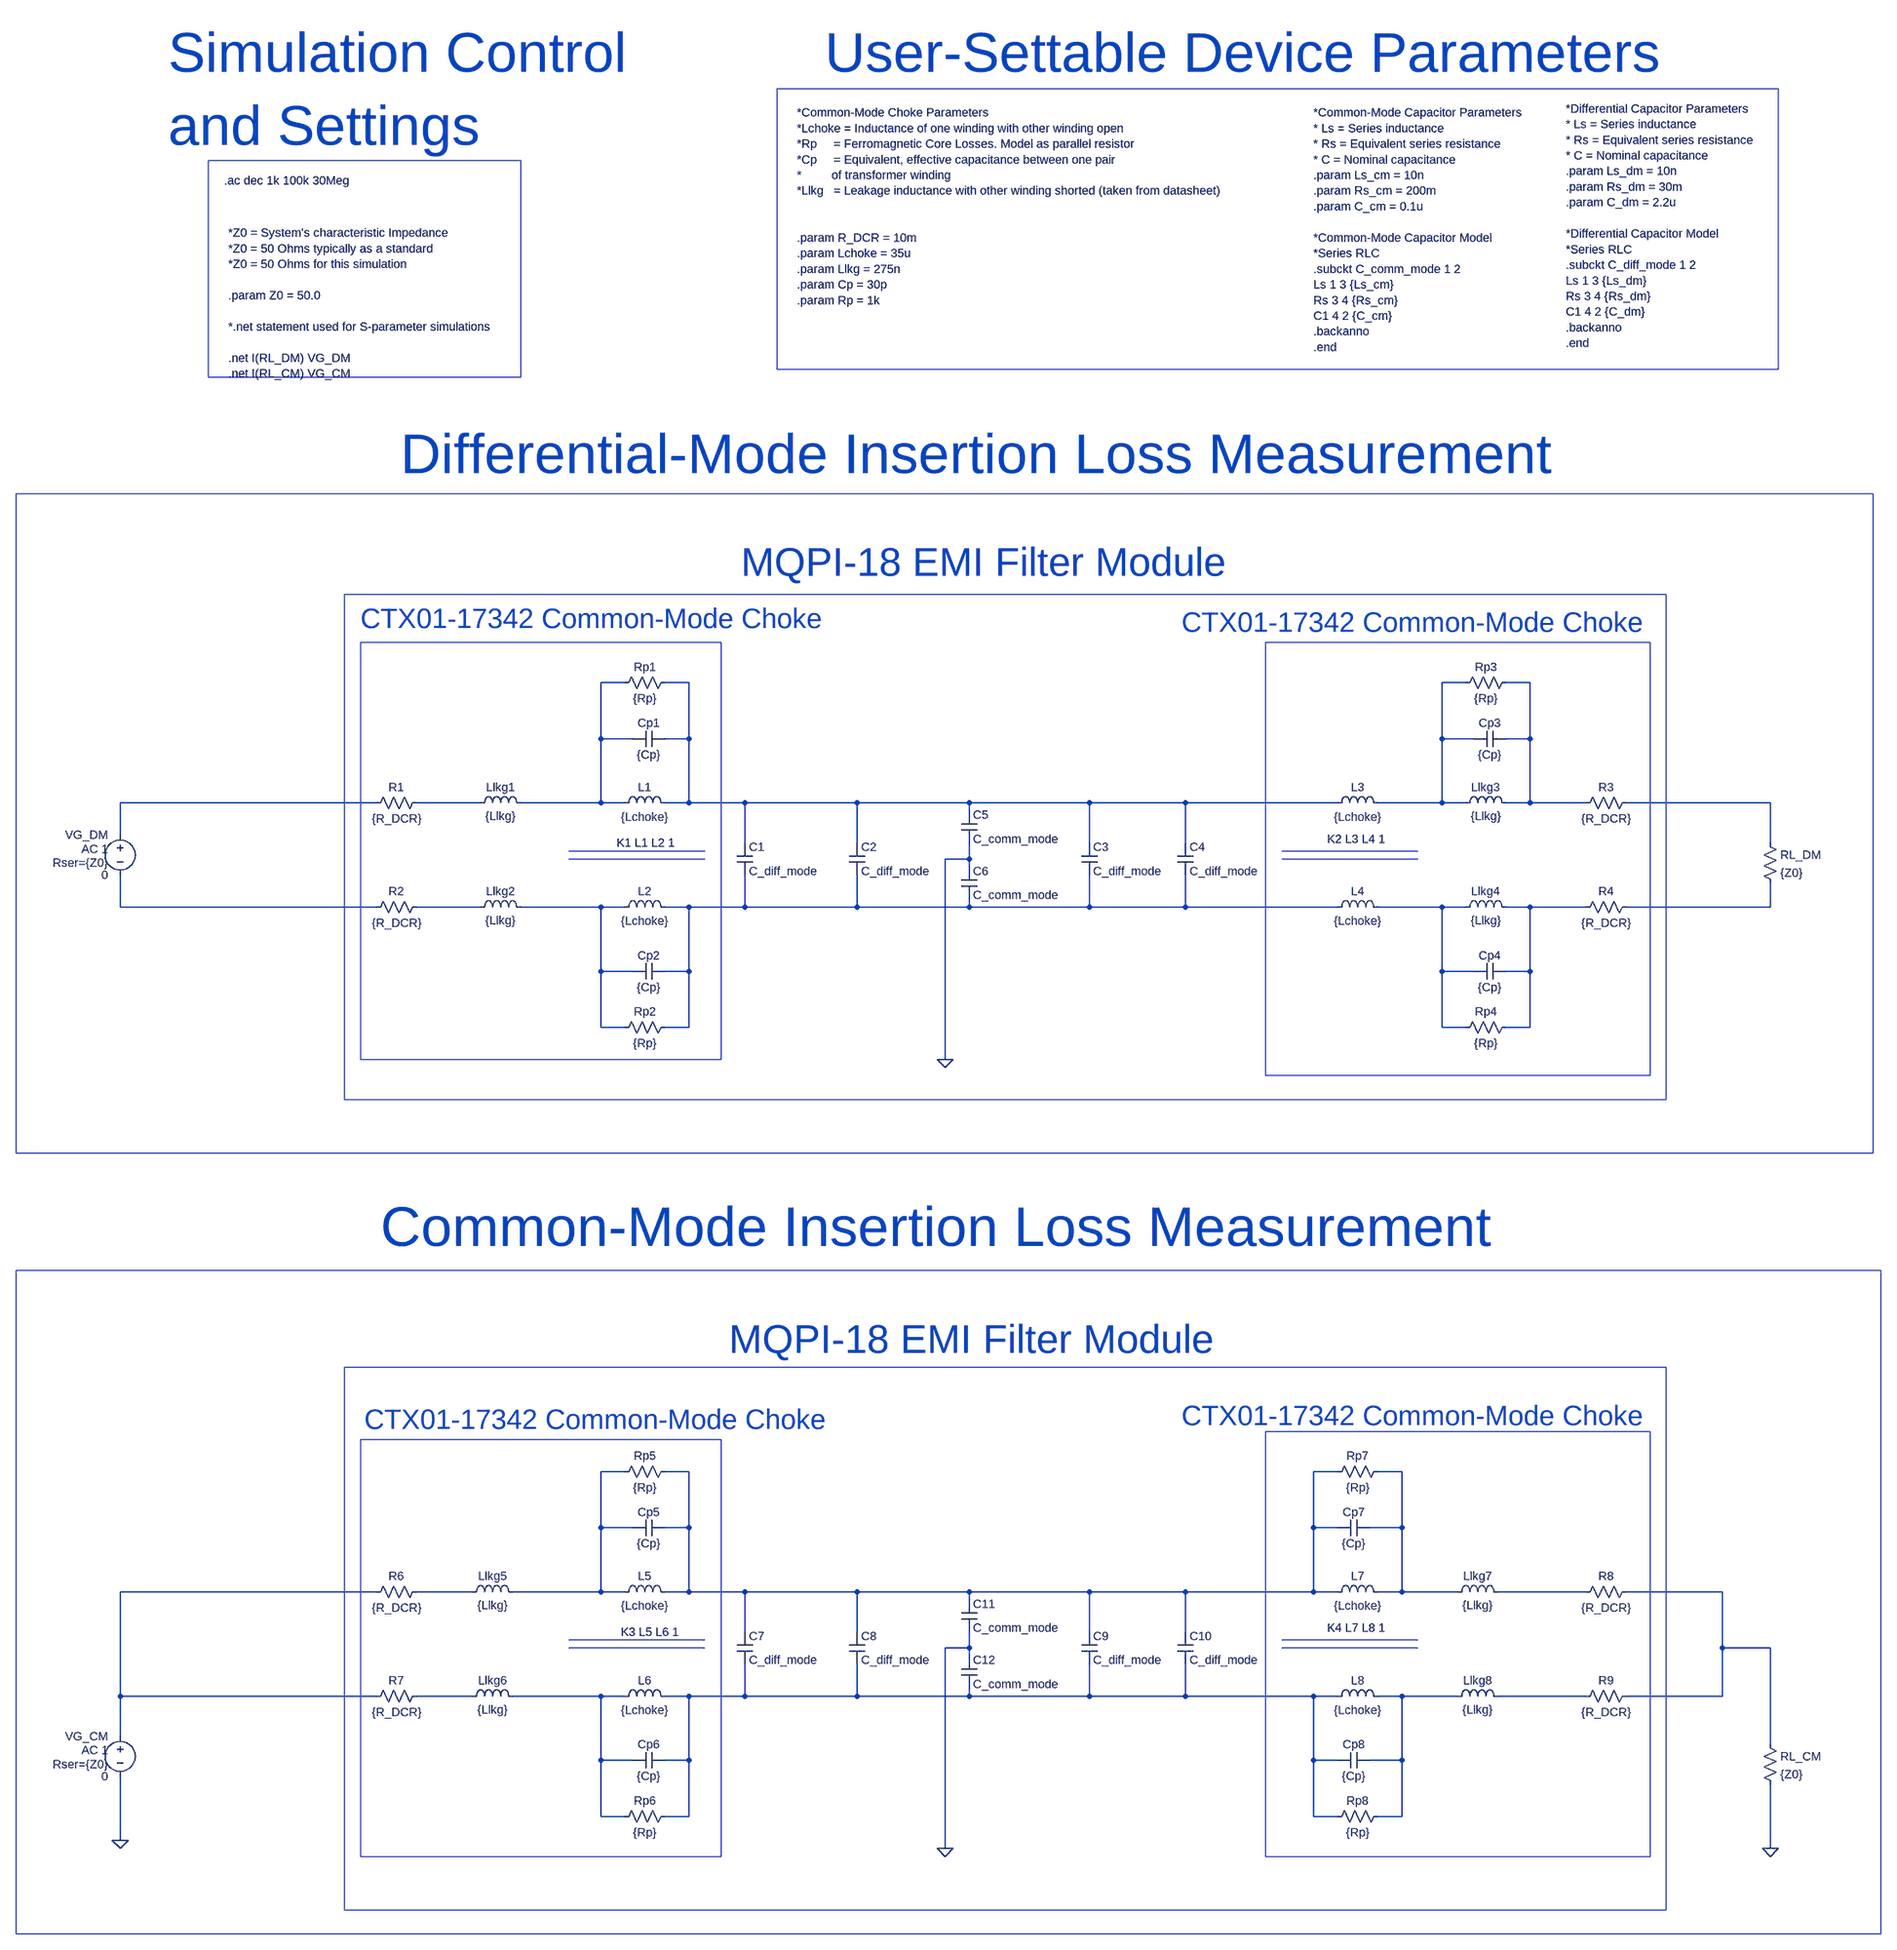
[diagram p0: schematic MQPI-18_VICOR_EMI_Filter.asc]
MQPI-18_VICOR_EMI_Filter.asc, the LTspice schematic file:
Version 4.1
SHEET 1 4008 2036
WIRE 1184 -672 1136 -672
WIRE 1312 -672 1264 -672
WIRE 2864 -672 2816 -672
WIRE 2992 -672 2944 -672
WIRE 1136 -560 1136 -672
WIRE 1200 -560 1136 -560
WIRE 1312 -560 1312 -672
WIRE 1312 -560 1264 -560
WIRE 2816 -560 2816 -672
WIRE 2880 -560 2816 -560
WIRE 2992 -560 2992 -672
WIRE 2992 -560 2944 -560
WIRE 688 -432 176 -432
WIRE 896 -432 768 -432
WIRE 1136 -432 1136 -560
WIRE 1136 -432 976 -432
WIRE 1184 -432 1136 -432
WIRE 1312 -432 1312 -560
WIRE 1312 -432 1264 -432
WIRE 1424 -432 1312 -432
WIRE 1648 -432 1424 -432
WIRE 1872 -432 1648 -432
WIRE 2112 -432 1872 -432
WIRE 2304 -432 2112 -432
WIRE 2608 -432 2304 -432
WIRE 2816 -432 2816 -560
WIRE 2816 -432 2688 -432
WIRE 2864 -432 2816 -432
WIRE 2992 -432 2992 -560
WIRE 2992 -432 2944 -432
WIRE 3104 -432 2992 -432
WIRE 3472 -432 3184 -432
WIRE 1872 -416 1872 -432
WIRE 176 -368 176 -432
WIRE 1424 -352 1424 -432
WIRE 1648 -352 1648 -432
WIRE 2112 -352 2112 -432
WIRE 2304 -352 2304 -432
WIRE 3472 -352 3472 -432
WIRE 1872 -320 1872 -352
WIRE 1872 -320 1824 -320
WIRE 1872 -304 1872 -320
WIRE 176 -224 176 -288
WIRE 688 -224 176 -224
WIRE 896 -224 768 -224
WIRE 1136 -224 976 -224
WIRE 1184 -224 1136 -224
WIRE 1312 -224 1264 -224
WIRE 1424 -224 1424 -288
WIRE 1424 -224 1312 -224
WIRE 1648 -224 1648 -288
WIRE 1648 -224 1424 -224
WIRE 1872 -224 1872 -240
WIRE 1872 -224 1648 -224
WIRE 2112 -224 2112 -288
WIRE 2112 -224 1872 -224
WIRE 2304 -224 2304 -288
WIRE 2304 -224 2112 -224
WIRE 2608 -224 2304 -224
WIRE 2816 -224 2688 -224
WIRE 2864 -224 2816 -224
WIRE 2992 -224 2944 -224
WIRE 3104 -224 2992 -224
WIRE 3472 -224 3472 -272
WIRE 3472 -224 3184 -224
WIRE 1136 -96 1136 -224
WIRE 1200 -96 1136 -96
WIRE 1312 -96 1312 -224
WIRE 1312 -96 1264 -96
WIRE 2816 -96 2816 -224
WIRE 2880 -96 2816 -96
WIRE 2992 -96 2992 -224
WIRE 2992 -96 2944 -96
WIRE 1136 16 1136 -96
WIRE 1184 16 1136 16
WIRE 1312 16 1312 -96
WIRE 1312 16 1264 16
WIRE 2816 16 2816 -96
WIRE 2864 16 2816 16
WIRE 2992 16 2992 -96
WIRE 2992 16 2944 16
WIRE 1824 80 1824 -320
WIRE 1184 1056 1136 1056
WIRE 1312 1056 1264 1056
WIRE 2608 1056 2560 1056
WIRE 2736 1056 2688 1056
WIRE 1136 1168 1136 1056
WIRE 1200 1168 1136 1168
WIRE 1312 1168 1312 1056
WIRE 1312 1168 1264 1168
WIRE 2560 1168 2560 1056
WIRE 2608 1168 2560 1168
WIRE 2736 1168 2736 1056
WIRE 2736 1168 2672 1168
WIRE 688 1296 176 1296
WIRE 880 1296 768 1296
WIRE 1136 1296 1136 1168
WIRE 1136 1296 960 1296
WIRE 1184 1296 1136 1296
WIRE 1312 1296 1312 1168
WIRE 1312 1296 1264 1296
WIRE 1424 1296 1312 1296
WIRE 1648 1296 1424 1296
WIRE 1872 1296 1648 1296
WIRE 2112 1296 1872 1296
WIRE 2304 1296 2112 1296
WIRE 2560 1296 2560 1168
WIRE 2560 1296 2304 1296
WIRE 2608 1296 2560 1296
WIRE 2736 1296 2736 1168
WIRE 2736 1296 2688 1296
WIRE 2848 1296 2736 1296
WIRE 3104 1296 2928 1296
WIRE 3376 1296 3184 1296
WIRE 1872 1312 1872 1296
WIRE 1424 1376 1424 1296
WIRE 1648 1376 1648 1296
WIRE 2112 1376 2112 1296
WIRE 2304 1376 2304 1296
WIRE 1872 1408 1872 1376
WIRE 1872 1408 1824 1408
WIRE 3376 1408 3376 1296
WIRE 3472 1408 3376 1408
WIRE 1872 1424 1872 1408
WIRE 176 1504 176 1296
WIRE 688 1504 176 1504
WIRE 880 1504 768 1504
WIRE 1136 1504 960 1504
WIRE 1184 1504 1136 1504
WIRE 1312 1504 1264 1504
WIRE 1424 1504 1424 1440
WIRE 1424 1504 1312 1504
WIRE 1648 1504 1648 1440
WIRE 1648 1504 1424 1504
WIRE 1872 1504 1872 1488
WIRE 1872 1504 1648 1504
WIRE 2112 1504 2112 1440
WIRE 2112 1504 1872 1504
WIRE 2304 1504 2304 1440
WIRE 2304 1504 2112 1504
WIRE 2560 1504 2304 1504
WIRE 2608 1504 2560 1504
WIRE 2736 1504 2688 1504
WIRE 2848 1504 2736 1504
WIRE 3104 1504 2928 1504
WIRE 3376 1504 3376 1408
WIRE 3376 1504 3184 1504
WIRE 176 1584 176 1504
WIRE 3472 1600 3472 1408
WIRE 1136 1632 1136 1504
WIRE 1200 1632 1136 1632
WIRE 1312 1632 1312 1504
WIRE 1312 1632 1264 1632
WIRE 2560 1632 2560 1504
WIRE 2608 1632 2560 1632
WIRE 2736 1632 2736 1504
WIRE 2736 1632 2672 1632
WIRE 1136 1744 1136 1632
WIRE 1184 1744 1136 1744
WIRE 1312 1744 1312 1632
WIRE 1312 1744 1264 1744
WIRE 2560 1744 2560 1632
WIRE 2608 1744 2560 1744
WIRE 2736 1744 2736 1632
WIRE 2736 1744 2688 1744
WIRE 176 1792 176 1664
WIRE 1824 1808 1824 1408
WIRE 3472 1808 3472 1680
FLAG 1824 80 0
FLAG 1824 1808 0
FLAG 176 1792 0
FLAG 3472 1808 0
SYMBOL ind 1280 -416 M270
WINDOW 0 32 56 VTop 2
WINDOW 3 4 56 VBottom 2
SYMATTR InstName L1
SYMATTR Value {Lchoke}
SYMATTR Type ind
SYMBOL ind 1280 -208 M270
WINDOW 0 32 56 VTop 2
WINDOW 3 4 56 VBottom 2
SYMATTR InstName L2
SYMATTR Value {Lchoke}
SYMATTR Type ind
SYMBOL ind 2592 -416 R270
WINDOW 0 32 56 VTop 2
WINDOW 3 4 56 VBottom 2
SYMATTR InstName L3
SYMATTR Value {Lchoke}
SYMATTR Type ind
SYMBOL ind 2592 -208 R270
WINDOW 0 32 56 VTop 2
WINDOW 3 4 56 VBottom 2
SYMATTR InstName L4
SYMATTR Value {Lchoke}
SYMATTR Type ind
SYMBOL cap 1408 -352 R0
SYMATTR InstName C1
SYMATTR Value C_diff_mode
SYMATTR Prefix X
SYMBOL cap 1632 -352 R0
SYMATTR InstName C2
SYMATTR Value C_diff_mode
SYMATTR Prefix X
SYMBOL cap 2096 -352 R0
SYMATTR InstName C3
SYMATTR Value C_diff_mode
SYMATTR Prefix X
SYMBOL cap 2288 -352 R0
SYMATTR InstName C4
SYMATTR Value C_diff_mode
SYMATTR Prefix X
SYMBOL cap 1856 -416 R0
SYMATTR InstName C5
SYMATTR Value C_comm_mode
SYMATTR Prefix X
SYMBOL cap 1856 -304 R0
SYMATTR InstName C6
SYMATTR Value C_comm_mode
SYMATTR Prefix X
SYMBOL res 3456 -368 R0
SYMATTR InstName RL_DM
SYMATTR Value {Z0}
SYMBOL voltage 176 -384 M0
WINDOW 123 24 44 Left 2
WINDOW 39 24 72 Left 2
SYMATTR InstName VG_DM
SYMATTR Value 0
SYMATTR Value2 AC 1
SYMATTR SpiceLine Rser={Z0}
SYMBOL res 672 -416 R270
WINDOW 0 32 56 VTop 2
WINDOW 3 0 56 VBottom 2
SYMATTR InstName R1
SYMATTR Value {R_DCR}
SYMBOL res 672 -208 R270
WINDOW 0 32 56 VTop 2
WINDOW 3 0 56 VBottom 2
SYMATTR InstName R2
SYMATTR Value {R_DCR}
SYMBOL res 3088 -416 R270
WINDOW 0 32 56 VTop 2
WINDOW 3 0 56 VBottom 2
SYMATTR InstName R3
SYMATTR Value {R_DCR}
SYMBOL res 3088 -208 R270
WINDOW 0 32 56 VTop 2
WINDOW 3 0 56 VBottom 2
SYMATTR InstName R4
SYMATTR Value {R_DCR}
SYMBOL ind 1280 1312 M270
WINDOW 0 32 56 VTop 2
WINDOW 3 4 56 VBottom 2
SYMATTR InstName L5
SYMATTR Value {Lchoke}
SYMATTR Type ind
SYMBOL ind 1280 1520 M270
WINDOW 0 32 56 VTop 2
WINDOW 3 4 56 VBottom 2
SYMATTR InstName L6
SYMATTR Value {Lchoke}
SYMATTR Type ind
SYMBOL ind 2592 1312 R270
WINDOW 0 32 56 VTop 2
WINDOW 3 4 56 VBottom 2
SYMATTR InstName L7
SYMATTR Value {Lchoke}
SYMATTR Type ind
SYMBOL ind 2592 1520 R270
WINDOW 0 32 56 VTop 2
WINDOW 3 4 56 VBottom 2
SYMATTR InstName L8
SYMATTR Value {Lchoke}
SYMATTR Type ind
SYMBOL cap 1408 1376 R0
SYMATTR InstName C7
SYMATTR Value C_diff_mode
SYMATTR Prefix X
SYMBOL cap 1632 1376 R0
SYMATTR InstName C8
SYMATTR Value C_diff_mode
SYMATTR Prefix X
SYMBOL cap 2096 1376 R0
SYMATTR InstName C9
SYMATTR Value C_diff_mode
SYMATTR Prefix X
SYMBOL cap 2288 1376 R0
SYMATTR InstName C10
SYMATTR Value C_diff_mode
SYMATTR Prefix X
SYMBOL cap 1856 1312 R0
SYMATTR InstName C11
SYMATTR Value C_comm_mode
SYMATTR Prefix X
SYMBOL cap 1856 1424 R0
SYMATTR InstName C12
SYMATTR Value C_comm_mode
SYMATTR Prefix X
SYMBOL res 3456 1584 R0
SYMATTR InstName RL_CM
SYMATTR Value {Z0}
SYMBOL voltage 176 1568 M0
WINDOW 123 24 44 Left 2
WINDOW 39 24 72 Left 2
SYMATTR InstName VG_CM
SYMATTR Value 0
SYMATTR Value2 AC 1
SYMATTR SpiceLine Rser={Z0}
SYMBOL res 672 1312 R270
WINDOW 0 32 56 VTop 2
WINDOW 3 0 56 VBottom 2
SYMATTR InstName R6
SYMATTR Value {R_DCR}
SYMBOL res 672 1520 R270
WINDOW 0 32 56 VTop 2
WINDOW 3 0 56 VBottom 2
SYMATTR InstName R7
SYMATTR Value {R_DCR}
SYMBOL res 3088 1312 R270
WINDOW 0 32 56 VTop 2
WINDOW 3 0 56 VBottom 2
SYMATTR InstName R8
SYMATTR Value {R_DCR}
SYMBOL res 3088 1520 R270
WINDOW 0 32 56 VTop 2
WINDOW 3 0 56 VBottom 2
SYMATTR InstName R9
SYMATTR Value {R_DCR}
SYMBOL ind 992 -416 M270
WINDOW 0 32 56 VTop 2
WINDOW 3 5 56 VBottom 2
SYMATTR InstName Llkg1
SYMATTR Value {Llkg}
SYMBOL ind 992 -208 M270
WINDOW 0 32 56 VTop 2
WINDOW 3 5 56 VBottom 2
SYMATTR InstName Llkg2
SYMATTR Value {Llkg}
SYMBOL ind 2848 -416 R270
WINDOW 0 32 56 VTop 2
WINDOW 3 5 56 VBottom 2
SYMATTR InstName Llkg3
SYMATTR Value {Llkg}
SYMBOL ind 2848 -208 R270
WINDOW 0 32 56 VTop 2
WINDOW 3 5 56 VBottom 2
SYMATTR InstName Llkg4
SYMATTR Value {Llkg}
SYMBOL ind 976 1312 M270
WINDOW 0 32 56 VTop 2
WINDOW 3 5 56 VBottom 2
SYMATTR InstName Llkg5
SYMATTR Value {Llkg}
SYMBOL ind 976 1520 M270
WINDOW 0 32 56 VTop 2
WINDOW 3 5 56 VBottom 2
SYMATTR InstName Llkg6
SYMATTR Value {Llkg}
SYMBOL ind 2832 1312 R270
WINDOW 0 32 56 VTop 2
WINDOW 3 5 56 VBottom 2
SYMATTR InstName Llkg7
SYMATTR Value {Llkg}
SYMBOL ind 2832 1520 R270
WINDOW 0 32 56 VTop 2
WINDOW 3 5 56 VBottom 2
SYMATTR InstName Llkg8
SYMATTR Value {Llkg}
SYMBOL cap 1200 -80 R270
WINDOW 0 32 32 VTop 2
WINDOW 3 0 32 VBottom 2
SYMATTR InstName Cp2
SYMATTR Value {Cp}
SYMBOL cap 1200 -544 R270
WINDOW 0 32 32 VTop 2
WINDOW 3 0 32 VBottom 2
SYMATTR InstName Cp1
SYMATTR Value {Cp}
SYMBOL cap 2880 -576 M90
WINDOW 0 0 32 VBottom 2
WINDOW 3 32 32 VTop 2
SYMATTR InstName Cp3
SYMATTR Value {Cp}
SYMBOL cap 2880 -112 M90
WINDOW 0 0 32 VBottom 2
WINDOW 3 32 32 VTop 2
SYMATTR InstName Cp4
SYMATTR Value {Cp}
SYMBOL cap 1200 1152 M90
WINDOW 0 0 32 VBottom 2
WINDOW 3 32 32 VTop 2
SYMATTR InstName Cp5
SYMATTR Value {Cp}
SYMBOL cap 1200 1616 M90
WINDOW 0 0 32 VBottom 2
WINDOW 3 32 32 VTop 2
SYMATTR InstName Cp6
SYMATTR Value {Cp}
SYMBOL cap 2672 1152 R90
WINDOW 0 0 32 VBottom 2
WINDOW 3 32 32 VTop 2
SYMATTR InstName Cp7
SYMATTR Value {Cp}
SYMBOL cap 2672 1616 R90
WINDOW 0 0 32 VBottom 2
WINDOW 3 32 32 VTop 2
SYMATTR InstName Cp8
SYMATTR Value {Cp}
SYMBOL res 1168 -656 R270
WINDOW 0 32 56 VTop 2
WINDOW 3 0 56 VBottom 2
SYMATTR InstName Rp1
SYMATTR Value {Rp}
SYMBOL res 1168 32 R270
WINDOW 0 32 56 VTop 2
WINDOW 3 0 56 VBottom 2
SYMATTR InstName Rp2
SYMATTR Value {Rp}
SYMBOL res 2848 -656 R270
WINDOW 0 32 56 VTop 2
WINDOW 3 0 56 VBottom 2
SYMATTR InstName Rp3
SYMATTR Value {Rp}
SYMBOL res 2848 32 R270
WINDOW 0 32 56 VTop 2
WINDOW 3 0 56 VBottom 2
SYMATTR InstName Rp4
SYMATTR Value {Rp}
SYMBOL res 1168 1072 R270
WINDOW 0 32 56 VTop 2
WINDOW 3 0 56 VBottom 2
SYMATTR InstName Rp5
SYMATTR Value {Rp}
SYMBOL res 1168 1760 R270
WINDOW 0 32 56 VTop 2
WINDOW 3 0 56 VBottom 2
SYMATTR InstName Rp6
SYMATTR Value {Rp}
SYMBOL res 2592 1072 R270
WINDOW 0 32 56 VTop 2
WINDOW 3 0 56 VBottom 2
SYMATTR InstName Rp7
SYMATTR Value {Rp}
SYMBOL res 2592 1760 R270
WINDOW 0 32 56 VTop 2
WINDOW 3 0 56 VBottom 2
SYMATTR InstName Rp8
SYMATTR Value {Rp}
TEXT 1168 -352 Left 2 !K1 L1 L2 1
TEXT 2704 -360 Right 2 !K2 L3 L4 1
TEXT 1528 -1968 Left 2 !*Common-Mode Choke Parameters\n*Lchoke = Inductance of one winding with other winding open\n*Rp     = Ferromagnetic Core Losses. Model as parallel resistor\n*Cp     = Equivalent, effective capacitance between one pair\n*         of transformer winding\n*Llkg   = Leakage inductance with other winding shorted (taken from datasheet)\n \n \n.param R_DCR = 10m\n.param Lchoke = 35u\n.param Llkg = 275n\n.param Cp = 30p\n.param Rp = 1k
TEXT 384 -1832 Left 2 !.ac dec 1k 100k 30Meg
TEXT 392 -1728 Left 2 !*Z0 = System's characteristic Impedance\n*Z0 = 50 Ohms typically as a standard\n*Z0 = 50 Ohms for this simulation\n \n.param Z0 = 50.0\n \n*.net statement used for S-parameter simulations\n \n.net I(RL_DM) VG_DM\n.net I(RL_CM) VG_CM
TEXT 3064 -1976 Left 2 !*Differential Capacitor Parameters\n* Ls = Series inductance\n* Rs = Equivalent series resistance \n* C = Nominal capacitance\n.param Ls_dm = 10n\n.param Rs_dm = 30m\n.param C_dm = 2.2u\n \n*Differential Capacitor Model\n*Series RLC\n.subckt C_diff_mode 1 2\nLs 1 3 {Ls_dm}\nRs 3 4 {Rs_dm}\nC1 4 2 {C_dm}\n.backanno\n.end
TEXT 2560 -1968 Left 2 !*Common-Mode Capacitor Parameters\n* Ls = Series inductance\n* Rs = Equivalent series resistance \n* C = Nominal capacitance\n.param Ls_cm = 10n\n.param Rs_cm = 200m\n.param C_cm = 0.1u\n \n*Common-Mode Capacitor Model\n*Series RLC\n.subckt C_comm_mode 1 2\nLs 1 3 {Ls_cm}\nRs 3 4 {Rs_cm}\nC1 4 2 {C_cm}\n.backanno\n.end
TEXT 1176 1376 Left 2 !K3 L5 L6 1
TEXT 2704 1368 Right 2 !K4 L7 L8 1
TEXT 1416 -912 Left 6 ;MQPI-18 EMI Filter Module
TEXT 1584 -2088 Left 7 ;User-Settable Device Parameters
TEXT 272 -2088 Left 7 ;Simulation Control\nand Settings
TEXT 656 -800 Left 5 ;CTX01-17342 Common-Mode Choke
TEXT 664 952 Left 5 ;CTX01-17342 Common-Mode Choke
TEXT 2296 944 Left 5 ;CTX01-17342 Common-Mode Choke
TEXT 2296 -792 Left 5 ;CTX01-17342 Common-Mode Choke
TEXT 736 -1136 Left 7 ;Differential-Mode Insertion Loss Measurement
TEXT 696 520 Left 7 ;Common-Mode Insertion Loss Measurement
TEXT 1392 792 Left 6 ;MQPI-18 EMI Filter Module
LINE Normal 1344 -336 1072 -336
LINE Normal 1344 -320 1072 -320
LINE Normal 2768 -336 2496 -336
LINE Normal 2768 -320 2496 -320
LINE Normal 1344 1392 1072 1392
LINE Normal 1344 1408 1072 1408
LINE Normal 2768 1392 2496 1392
LINE Normal 2768 1408 2496 1408
RECTANGLE Normal 3264 160 624 -848
RECTANGLE Normal 3264 1984 624 848
RECTANGLE Normal 3488 -1456 1488 -2016
RECTANGLE Normal 976 -1440 352 -1872
RECTANGLE Normal 1376 80 656 -752
RECTANGLE Normal 3232 112 2464 -752
RECTANGLE Normal 3232 1824 2464 976
RECTANGLE Normal 1376 1824 656 992
RECTANGLE Normal 3744 272 -32 -1056
RECTANGLE Normal 3760 2032 -32 608

The netlist it stands for:
* MQPI-18_VICOR_EMI_Filter.asc
L1 N002 N001 {Lchoke}
L2 N011 N010 {Lchoke}
L3 N002 N003 {Lchoke}
L4 N011 N012 {Lchoke}
X§C1 N002 N011 C_diff_mode  ; pins A B
X§C2 N002 N011 C_diff_mode  ; pins A B
X§C3 N002 N011 C_diff_mode  ; pins A B
X§C4 N002 N011 C_diff_mode  ; pins A B
X§C5 N002 0 C_comm_mode  ; pins A B
X§C6 0 N011 C_comm_mode  ; pins A B
RL_DM N007 N014 {Z0}
VG_DM N005 N008 0 AC 1 Rser={Z0}
R1 N005 N006 {R_DCR}
R2 N008 N009 {R_DCR}
R3 N004 N007 {R_DCR}
R4 N013 N014 {R_DCR}
L5 N016 N015 {Lchoke}
L6 N024 N023 {Lchoke}
L7 N016 N017 {Lchoke}
L8 N024 N025 {Lchoke}
X§C7 N016 N024 C_diff_mode  ; pins A B
X§C8 N016 N024 C_diff_mode  ; pins A B
X§C9 N016 N024 C_diff_mode  ; pins A B
X§C10 N016 N024 C_diff_mode  ; pins A B
X§C11 N016 0 C_comm_mode  ; pins A B
X§C12 0 N024 C_comm_mode  ; pins A B
RL_CM N021 0 {Z0}
VG_CM N018 0 0 AC 1 Rser={Z0}
R6 N018 N019 {R_DCR}
R7 N018 N022 {R_DCR}
R8 N020 N021 {R_DCR}
R9 N026 N021 {R_DCR}
Llkg1 N001 N006 {Llkg}
Llkg2 N010 N009 {Llkg}
Llkg3 N003 N004 {Llkg}
Llkg4 N012 N013 {Llkg}
Llkg5 N015 N019 {Llkg}
Llkg6 N023 N022 {Llkg}
Llkg7 N017 N020 {Llkg}
Llkg8 N025 N026 {Llkg}
Cp2 N010 N011 {Cp}
Cp1 N001 N002 {Cp}
Cp3 N003 N004 {Cp}
Cp4 N012 N013 {Cp}
Cp5 N015 N016 {Cp}
Cp6 N023 N024 {Cp}
Cp7 N017 N016 {Cp}
Cp8 N025 N024 {Cp}
Rp1 N001 N002 {Rp}
Rp2 N010 N011 {Rp}
Rp3 N003 N004 {Rp}
Rp4 N012 N013 {Rp}
Rp5 N015 N016 {Rp}
Rp6 N023 N024 {Rp}
Rp7 N016 N017 {Rp}
Rp8 N024 N025 {Rp}
K1 L1 L2 1
K2 L3 L4 1
*Common-Mode Choke Parameters
*Lchoke = Inductance of one winding with other winding open
*Rp     = Ferromagnetic Core Losses. Model as parallel resistor
*Cp     = Equivalent, effective capacitance between one pair
*         of transformer winding
*Llkg   = Leakage inductance with other winding shorted (taken from datasheet)
.param R_DCR = 10m
.param Lchoke = 35u
.param Llkg = 275n
.param Cp = 30p
.param Rp = 1k
.ac dec 1k 100k 30Meg
*Z0 = System's characteristic Impedance
*Z0 = 50 Ohms typically as a standard
*Z0 = 50 Ohms for this simulation
.param Z0 = 50.0
*.net statement used for S-parameter simulations
.net I(RL_DM) VG_DM
.net I(RL_CM) VG_CM
*Differential Capacitor Parameters
* Ls = Series inductance
* Rs = Equivalent series resistance
* C = Nominal capacitance
.param Ls_dm = 10n
.param Rs_dm = 30m
.param C_dm = 2.2u
*Differential Capacitor Model
*Series RLC
.subckt C_diff_mode 1 2
Ls 1 3 {Ls_dm}
Rs 3 4 {Rs_dm}
C1 4 2 {C_dm}
.backanno
.end
*Common-Mode Capacitor Parameters
* Ls = Series inductance
* Rs = Equivalent series resistance
* C = Nominal capacitance
.param Ls_cm = 10n
.param Rs_cm = 200m
.param C_cm = 0.1u
*Common-Mode Capacitor Model
*Series RLC
.subckt C_comm_mode 1 2
Ls 1 3 {Ls_cm}
Rs 3 4 {Rs_cm}
C1 4 2 {C_cm}
.backanno
.end
K3 L5 L6 1
K4 L7 L8 1
* MQPI-18 EMI Filter Module
* User-Settable Device Parameters
* Simulation Control
* and Settings
* CTX01-17342 Common-Mode Choke
* CTX01-17342 Common-Mode Choke
* CTX01-17342 Common-Mode Choke
* CTX01-17342 Common-Mode Choke
* Differential-Mode Insertion Loss Measurement
* Common-Mode Insertion Loss Measurement
* MQPI-18 EMI Filter Module
.backanno
.end